# EAGLE board main (EAGLE 6.1)
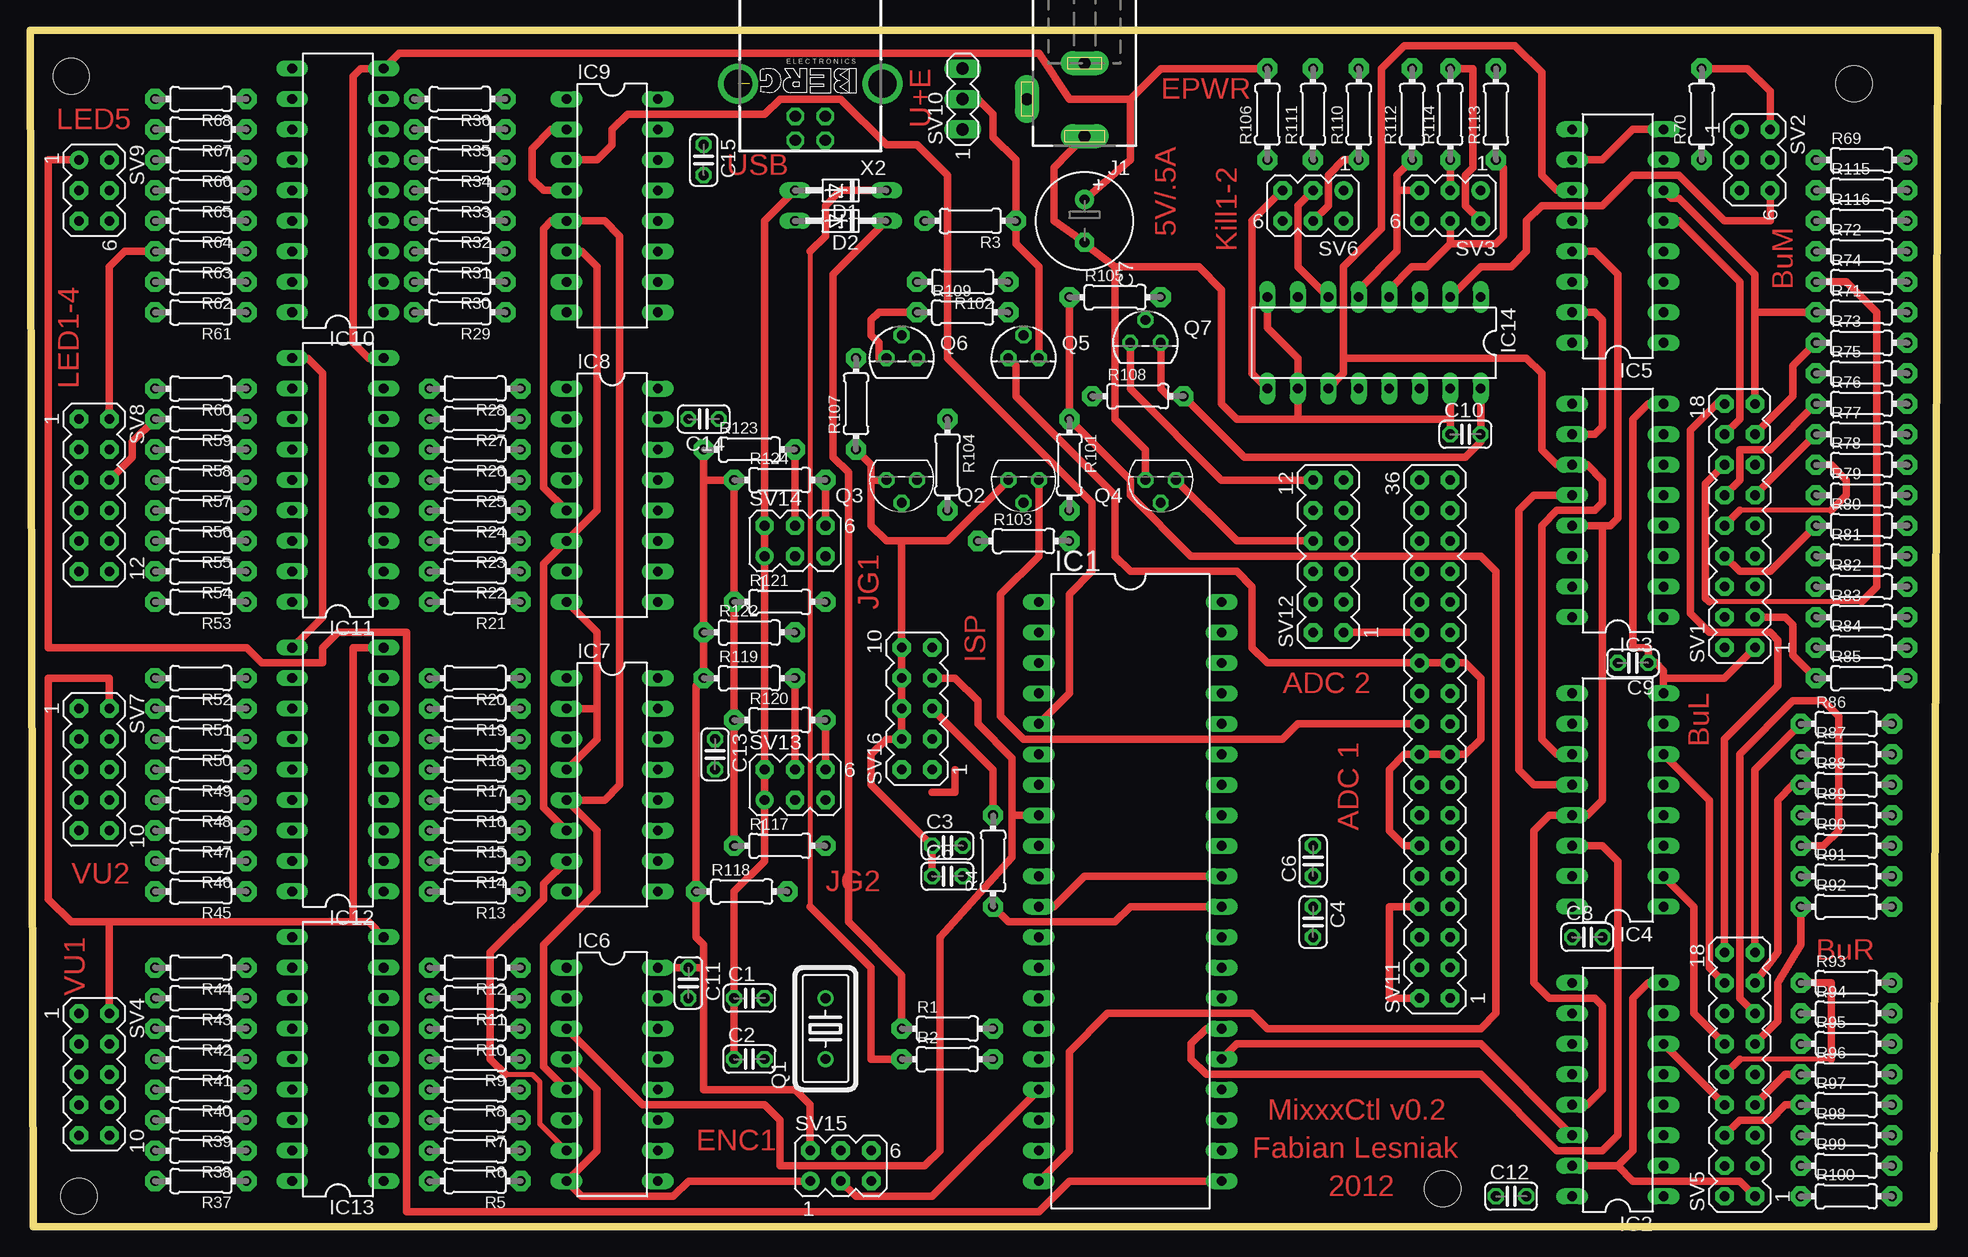
[diagram p1: board, top side]
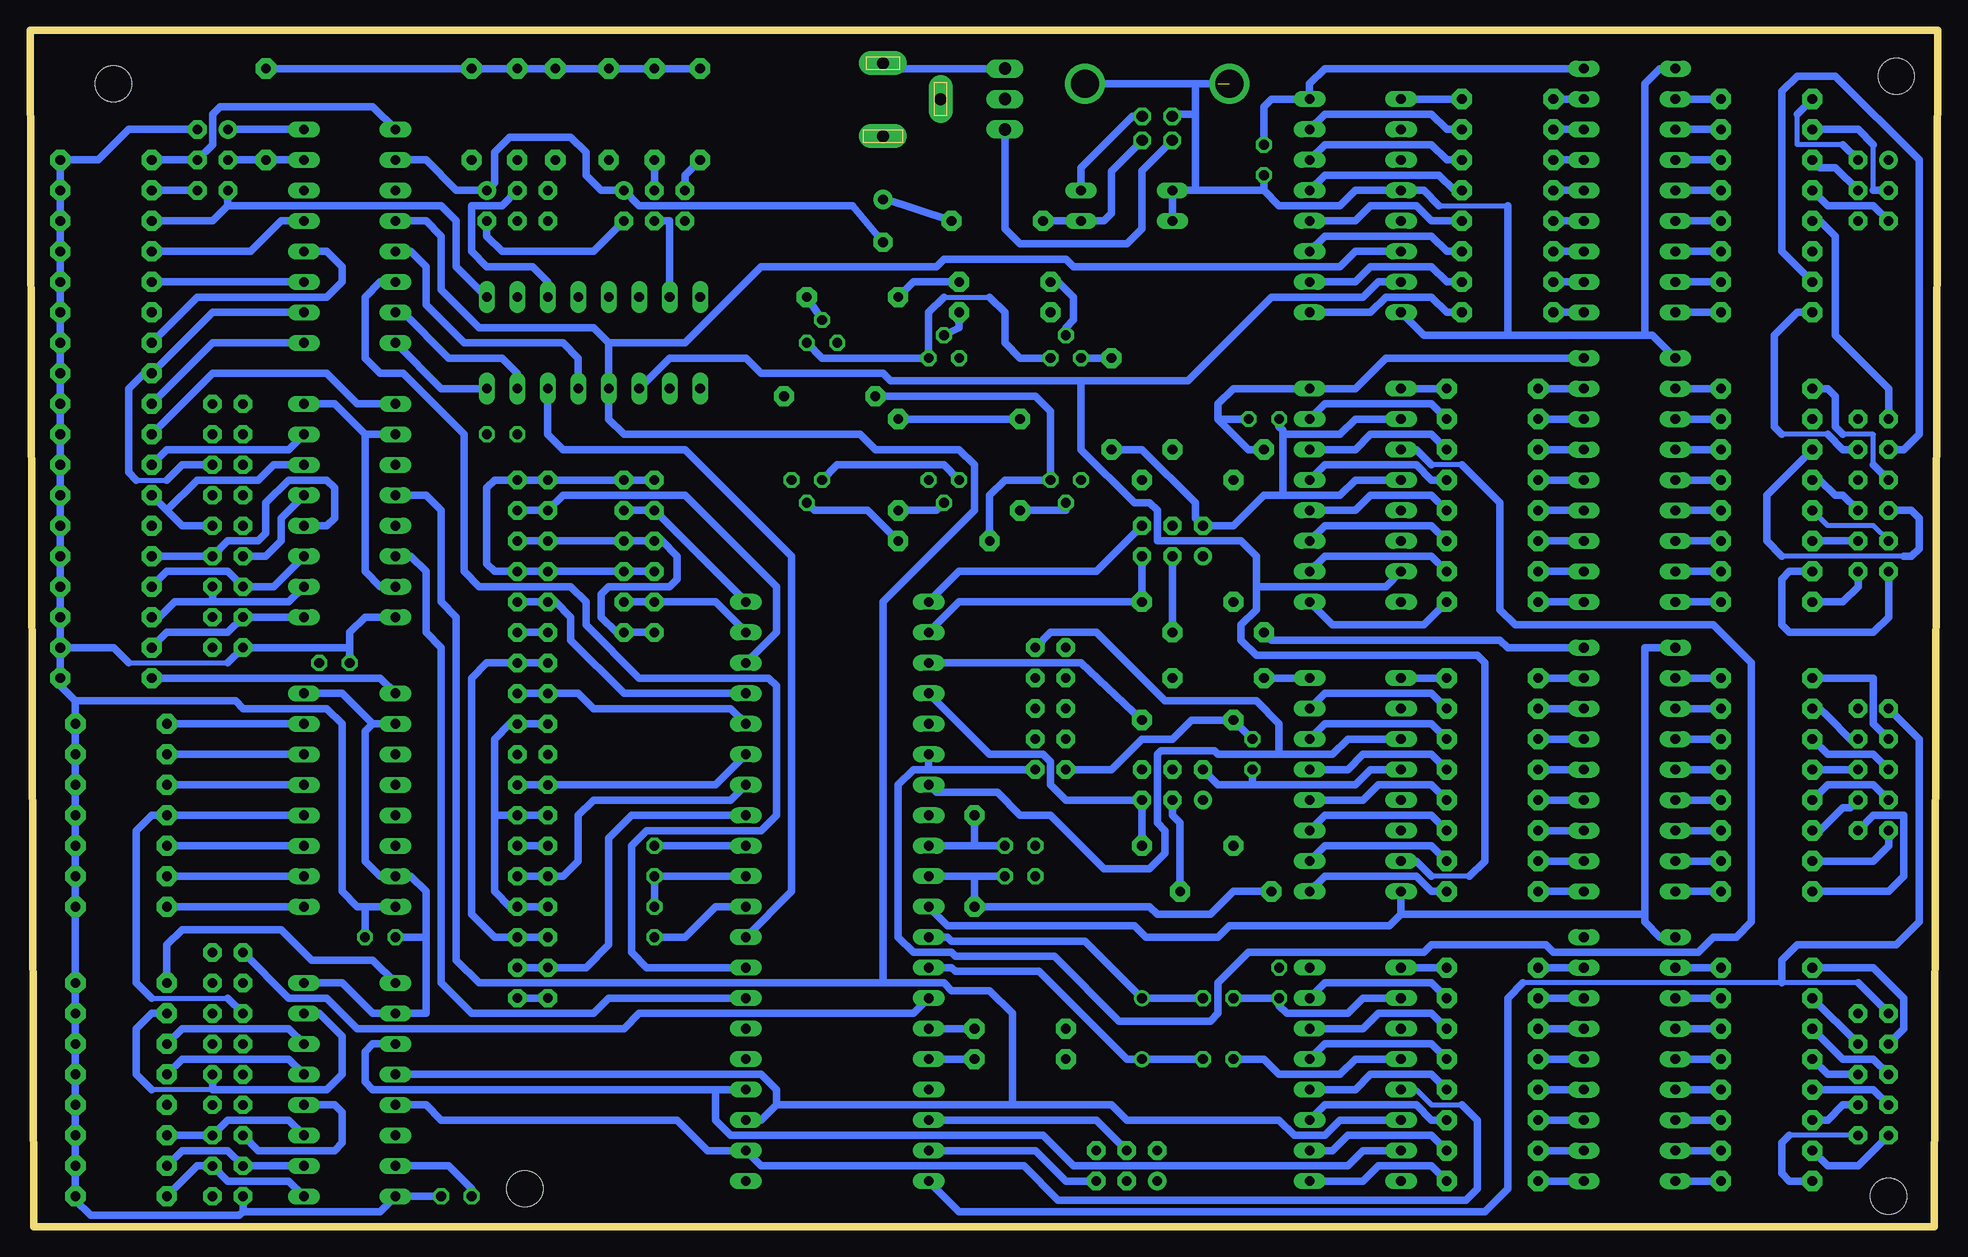
[diagram p2: board, bottom side, seen from below]

Size 159 x 99.73 mm. Coordinates in mm from the lower left corner, seen from the top.
Outline: 0.27,0 158.69,0 159,99.73 0,99.73 0.27,0
Copper layers (1*16): Top 0.035mm / dielectric 1.5mm / Bottom 0.035mm
Design rules "default": minimum track width 10mil, minimum drill 24mil, track to track 8mil, track to pad 8mil, pad to pad 8mil, via to via 8mil, smd to smd 8mil, copper to edge 40mil, drill to drill 8mil, minimum pad ring 10mil, minimum via ring 8mil, stop-mask expansion 4mil, vias tented up to drill 0mil, thermal gap 10mil
Net classes: 1 supply: width 0.015 mm
Holes 3 mm at 3.45,95.89 152.03,95.25 117.75,3.18 4.08,2.54

## Footprints (pad centres in the part's own frame; a part is rotated, then mirrored left to right if it is on the bottom)
C025-024X044 = drill 0.813 octagon: 1 -1.27,0; 2 1.27,0
E3,5-8 = drill 0.813 pad 1.6: + -1.778,0 | drill 0.813 pad 1.6 octagon: - 1.778,0
DO34Z7 = drill 0.813 long: A 3.81,0; C -3.81,0
DIL40 = drill 0.813 long: 1 -24.13,-7.62; 2 -21.59,-7.62; 3 -19.05,-7.62; 4 -16.51,-7.62; 5 -13.97,-7.62; 6 -11.43,-7.62; 7 -8.89,-7.62; 8 -6.35,-7.62; 9 -3.81,-7.62; 10 -1.27,-7.62; 11 1.27,-7.62; 12 3.81,-7.62; 13 6.35,-7.62; 14 8.89,-7.62; 15 11.43,-7.62; 16 13.97,-7.62; 17 16.51,-7.62; 18 19.05,-7.62; 19 21.59,-7.62; 20 24.13,-7.62; 21 24.13,7.62; 22 21.59,7.62; 23 19.05,7.62; 24 16.51,7.62; 25 13.97,7.62; 26 11.43,7.62; 27 8.89,7.62; 28 6.35,7.62; 29 3.81,7.62; 30 1.27,7.62; 31 -1.27,7.62; 32 -3.81,7.62; 33 -6.35,7.62; 34 -8.89,7.62; 35 -11.43,7.62; 36 -13.97,7.62; 37 -16.51,7.62; 38 -19.05,7.62; 39 -21.59,7.62; 40 -24.13,7.62
DIL16 = drill 0.813 long: 1 -8.89,-3.81; 2 -6.35,-3.81; 3 -3.81,-3.81; 4 -1.27,-3.81; 5 1.27,-3.81; 6 3.81,-3.81; 7 6.35,-3.81; 8 8.89,-3.81; 9 8.89,3.81; 10 6.35,3.81; 11 3.81,3.81; 12 1.27,3.81; 13 -1.27,3.81; 14 -3.81,3.81; 15 -6.35,3.81; 16 -8.89,3.81
DIL18 = drill 0.813 long: 1 -10.16,-3.81; 2 -7.62,-3.81; 3 -5.08,-3.81; 4 -2.54,-3.81; 5 0,-3.81; 6 2.54,-3.81; 7 5.08,-3.81; 8 7.62,-3.81; 9 10.16,-3.81; 10 10.16,3.81; 11 7.62,3.81; 12 5.08,3.81; 13 2.54,3.81; 14 0,3.81; 15 -2.54,3.81; 16 -5.08,3.81; 17 -7.62,3.81; 18 -10.16,3.81
DCJ0202 = drill 1 pad 2 long: 1 0,3.1; 2 4.8,0; 3 0,-3
HC18U-V = drill 0.813: 1 -2.54,0; 2 2.54,0
TO92 = drill 0.813 octagon: 1 1.27,0; 2 0,1.905; 3 -1.27,0
0204/7 = drill 0.813 pad 1.676 octagon: 1 -3.81,0; 2 3.81,0
MA09-2 = drill 0.8 pad 1.524 octagon: 1 -10.16,-1.27; 2 -10.16,1.27; 3 -7.62,-1.27; 4 -7.62,1.27; 5 -5.08,-1.27; 6 -5.08,1.27; 7 -2.54,-1.27; 8 -2.54,1.27; 9 0,-1.27; 10 0,1.27; 11 2.54,-1.27; 12 2.54,1.27; 13 5.08,-1.27; 14 5.08,1.27; 15 7.62,-1.27; 16 7.62,1.27; 17 10.16,-1.27; 18 10.16,1.27
MA03-2 = drill 0.8 pad 1.524: 1 -2.54,-1.27 | drill 0.8 pad 1.524 octagon: 2 -2.54,1.27; 3 0,-1.27; 4 0,1.27; 5 2.54,-1.27; 6 2.54,1.27
MA05-2 = drill 0.8 pad 1.524 octagon: 1 -5.08,-1.27; 2 -5.08,1.27; 3 -2.54,-1.27; 4 -2.54,1.27; 5 0,-1.27; 6 0,1.27; 7 2.54,-1.27; 8 2.54,1.27; 9 5.08,-1.27; 10 5.08,1.27
MA06-2 = drill 0.8 pad 1.524 octagon: 1 -6.35,-1.27; 2 -6.35,1.27; 3 -3.81,-1.27; 4 -3.81,1.27; 5 -1.27,-1.27; 6 -1.27,1.27; 7 1.27,-1.27; 8 1.27,1.27; 9 3.81,-1.27; 10 3.81,1.27; 11 6.35,-1.27; 12 6.35,1.27
MA03-1 = drill 1.016 long: 1 -2.54,0; 2 0,0; 3 2.54,0
MA18-2 = drill 0.8 pad 1.524 octagon: 1 -21.59,-1.27; 2 -21.59,1.27; 3 -19.05,-1.27; 4 -19.05,1.27; 5 -16.51,-1.27; 6 -16.51,1.27; 7 -13.97,-1.27; 8 -13.97,1.27; 9 -11.43,-1.27; 10 -11.43,1.27; 11 -8.89,-1.27; 12 -8.89,1.27; 13 -6.35,-1.27; 14 -6.35,1.27; 15 -3.81,-1.27; 16 -3.81,1.27; 17 -1.27,-1.27; 18 -1.27,1.27; 19 1.27,-1.27; 20 1.27,1.27; 21 3.81,-1.27; 22 3.81,1.27; 23 6.35,-1.27; 24 6.35,1.27; 25 8.89,-1.27; 26 8.89,1.27; 27 11.43,-1.27; 28 11.43,1.27; 29 13.97,-1.27; 30 13.97,1.27; 31 16.51,-1.27; 32 16.51,1.27; 33 19.05,-1.27; 34 19.05,1.27; 35 21.59,-1.27; 36 21.59,1.27
PN61729-S = drill 0.95 octagon: 1 1.25,4.71; 2 -1.25,4.71; 3 -1.25,2.71; 4 1.25,2.71 | drill 2.3 pad 2.9: S1 -6.02,0; S2 6.02,0

## Placement (x,y rotation side)
C1  22p  [C025-024X044]  59.96,19.05 0 top
C2  22p  [C025-024X044]  59.96,13.97 0 top
C3  47n  [C025-024X044]  76.47,31.75 0 top
C4  100n  [C025-024X044]  106.95,25.4 270 top
C5  100n  [C025-024X044]  76.47,29.21 0 top
C6  100n  [C025-024X044]  106.95,30.48 90 top
C7  100u  [E3,5-8]  87.9,83.82 270 top
C8  100n  [C025-024X044]  129.81,24.13 0 top
C9  100n  [C025-024X044]  133.62,46.99 180 top
C10  100n  [C025-024X044]  119.65,66.04 0 top
C11  100n  [C025-024X044]  54.88,20.32 270 top
C12  100n  [C025-024X044]  123.46,2.54 0 top
C13  100n  [C025-024X044]  57.1,39.37 270 top
C14  100n  [C025-024X044]  56.15,67.31 180 top
C15  100n  [C025-024X044]  56.15,88.9 270 top
D1  3,6  [DO34Z7]  67.58,86.36 180 top
D2  3,6  [DO34Z7]  67.58,83.82 180 top
IC1  ATMEGA644-20PU  [DIL40]  91.71,27.94 270 top
IC2  4512N  [DIL16]  132.35,11.43 90 top
IC3  4512N  [DIL16]  132.35,59.69 90 top
IC4  4512N  [DIL16]  132.35,35.56 90 top
IC5  4512N  [DIL16]  132.35,82.55 90 top
IC6  4099N  [DIL16]  48.53,12.7 270 top
IC7  4099N  [DIL16]  48.53,36.83 270 top
IC8  4099N  [DIL16]  48.53,60.96 270 top
IC9  4099N  [DIL16]  48.53,85.09 270 top
IC10  UDN2981A  [DIL18]  25.67,86.36 90 top
IC11  UDN2981A  [DIL18]  25.67,62.23 90 top
IC12  UDN2981A  [DIL18]  25.67,38.1 90 top
IC13  UDN2981A  [DIL18]  25.67,13.97 90 top
IC14  4512N  [DIL16]  112.03,73.66 180 top
J1  DCJ0202  [DCJ0202]  87.9,93.98 180 top
Q1  20MHz  [HC18U-V]  66.31,16.51 90 top
Q2  BC547B  [TO92]  82.82,62.23 180 top
Q3  BC547B  [TO92]  72.66,62.23 180 top
Q4  BC547B  [TO92]  94.25,62.23 180 top
Q5  BC557  [TO92]  82.82,72.39 0 top
Q6  BC557  [TO92]  72.66,72.39 0 top
Q7  BC557  [TO92]  92.98,73.66 0 top
R1  68  [0204/7]  76.47,16.51 0 top
R2  68  [0204/7]  76.47,13.97 0 top
R3  1k5  [0204/7]  78.38,83.82 180 top
R4  100k  [0204/7]  80.28,30.48 90 top
R5  100k  [0204/7]  37.1,3.81 180 top
R6  100k  [0204/7]  37.1,6.35 180 top
R7  100k  [0204/7]  37.1,8.89 180 top
R8  100k  [0204/7]  37.1,11.43 180 top
R9  100k  [0204/7]  37.1,13.97 180 top
R10  100k  [0204/7]  37.1,16.51 180 top
R11  100k  [0204/7]  37.1,19.05 180 top
R12  100k  [0204/7]  37.1,21.59 180 top
R13  100k  [0204/7]  37.1,27.94 180 top
R14  100k  [0204/7]  37.1,30.48 180 top
R15  100k  [0204/7]  37.1,33.02 180 top
R16  100k  [0204/7]  37.1,35.56 180 top
R17  100k  [0204/7]  37.1,38.1 180 top
R18  100k  [0204/7]  37.1,40.64 180 top
R19  100k  [0204/7]  37.1,43.18 180 top
R20  100k  [0204/7]  37.1,45.72 180 top
R21  100k  [0204/7]  37.1,52.07 180 top
R22  100k  [0204/7]  37.1,54.61 180 top
R23  100k  [0204/7]  37.1,57.15 180 top
R24  100k  [0204/7]  37.1,59.69 180 top
R25  100k  [0204/7]  37.1,62.23 180 top
R26  100k  [0204/7]  37.1,64.77 180 top
R27  100k  [0204/7]  37.1,67.31 180 top
R28  100k  [0204/7]  37.1,69.85 180 top
R29  100k  [0204/7]  35.83,76.2 180 top
R30  100k  [0204/7]  35.83,78.74 180 top
R31  100k  [0204/7]  35.83,81.28 180 top
R32  100k  [0204/7]  35.83,83.82 180 top
R33  100k  [0204/7]  35.83,86.36 180 top
R34  100k  [0204/7]  35.83,88.9 180 top
R35  100k  [0204/7]  35.83,91.44 180 top
R36  100k  [0204/7]  35.83,93.98 180 top
R37  100  [0204/7]  14.24,3.81 180 top
R38  100  [0204/7]  14.24,6.35 180 top
R39  100  [0204/7]  14.24,8.89 180 top
R40  100  [0204/7]  14.24,11.43 180 top
R41  100  [0204/7]  14.24,13.97 180 top
R42  100  [0204/7]  14.24,16.51 180 top
R43  100  [0204/7]  14.24,19.05 180 top
R44  100  [0204/7]  14.24,21.59 180 top
R45  100  [0204/7]  14.24,27.94 180 top
R46  100  [0204/7]  14.24,30.48 180 top
R47  100  [0204/7]  14.24,33.02 180 top
R48  100  [0204/7]  14.24,35.56 180 top
R49  100  [0204/7]  14.24,38.1 180 top
R50  100  [0204/7]  14.24,40.64 180 top
R51  100  [0204/7]  14.24,43.18 180 top
R52  100  [0204/7]  14.24,45.72 180 top
R53  100  [0204/7]  14.24,52.07 180 top
R54  100  [0204/7]  14.24,54.61 180 top
R55  100  [0204/7]  14.24,57.15 180 top
R56  100  [0204/7]  14.24,59.69 180 top
R57  100  [0204/7]  14.24,62.23 180 top
R58  100  [0204/7]  14.24,64.77 180 top
R59  100  [0204/7]  14.24,67.31 180 top
R60  100  [0204/7]  14.24,69.85 180 top
R61  100  [0204/7]  14.24,76.2 180 top
R62  100  [0204/7]  14.24,78.74 180 top
R63  100  [0204/7]  14.24,81.28 180 top
R64  100  [0204/7]  14.24,83.82 180 top
R65  100  [0204/7]  14.24,86.36 180 top
R66  100  [0204/7]  14.24,88.9 180 top
R67  100  [0204/7]  14.24,91.44 180 top
R68  100  [0204/7]  14.24,93.98 180 top
R69  100k  [0204/7]  152.67,88.9 0 top
R70  100k  [0204/7]  139.34,92.71 90 top
R71  100k  [0204/7]  152.67,76.2 0 top
R72  100k  [0204/7]  152.67,81.28 0 top
R73  100k  [0204/7]  152.67,73.66 0 top
R74  100k  [0204/7]  152.67,78.74 0 top
R75  100k  [0204/7]  152.67,71.12 0 top
R76  100k  [0204/7]  152.67,68.58 0 top
R77  100k  [0204/7]  152.67,66.04 0 top
R78  100k  [0204/7]  152.67,63.5 0 top
R79  100k  [0204/7]  152.67,60.96 0 top
R80  100k  [0204/7]  152.67,58.42 0 top
R81  100k  [0204/7]  152.67,55.88 0 top
R82  100k  [0204/7]  152.67,53.34 0 top
R83  100k  [0204/7]  152.67,50.8 0 top
R84  100k  [0204/7]  152.67,48.26 0 top
R85  100k  [0204/7]  152.67,45.72 0 top
R86  100k  [0204/7]  151.4,41.91 0 top
R87  100k  [0204/7]  151.4,39.37 0 top
R88  100k  [0204/7]  151.4,36.83 0 top
R89  100k  [0204/7]  151.4,34.29 0 top
R90  100k  [0204/7]  151.4,31.75 0 top
R91  100k  [0204/7]  151.4,29.21 0 top
R92  100k  [0204/7]  151.4,26.67 0 top
R93  100k  [0204/7]  151.4,20.32 0 top
R94  100k  [0204/7]  151.4,17.78 0 top
R95  100k  [0204/7]  151.4,15.24 0 top
R96  100k  [0204/7]  151.4,12.7 0 top
R97  100k  [0204/7]  151.4,10.16 0 top
R98  100k  [0204/7]  151.4,7.62 0 top
R99  100k  [0204/7]  151.4,5.08 0 top
R100  100k  [0204/7]  151.4,2.54 0 top
R101  100k  [0204/7]  86.63,63.5 270 top
R102  100k  [0204/7]  77.74,78.74 180 top
R103  100k  [0204/7]  82.82,57.15 0 top
R104  100k  [0204/7]  76.47,63.5 270 top
R105  100k  [0204/7]  90.44,77.47 0 top
R106  100k  [0204/7]  103.14,92.71 90 top
R107  100k  [0204/7]  68.85,68.58 90 top
R108  100k  [0204/7]  92.34,69.22 0 top
R109  100k  [0204/7]  77.74,76.2 0 top
R110  100k  [0204/7]  110.76,92.71 90 top
R111  100k  [0204/7]  106.95,92.71 90 top
R112  100k  [0204/7]  115.2,92.71 90 top
R113  100k  [0204/7]  122.19,92.71 90 top
R114  100k  [0204/7]  118.38,92.71 90 top
R115  100k  [0204/7]  152.67,86.36 0 top
R116  100k  [0204/7]  152.67,83.82 0 top
R117  100k  [0204/7]  62.5,31.75 0 top
R118  430  [0204/7]  59.33,27.94 0 top
R119  430  [0204/7]  59.96,45.72 0 top
R120  100k  [0204/7]  62.5,42.23 0 top
R121  100k  [0204/7]  62.5,52.07 0 top
R122  430  [0204/7]  59.96,49.53 0 top
R123  430  [0204/7]  59.96,64.77 0 top
R124  100k  [0204/7]  62.5,62.23 0 top
SV1  [MA09-2]  142.51,58.42 90 top
SV2  [MA03-2]  143.78,88.9 270 top
SV3  [MA03-2]  118.38,85.09 180 top
SV4  [MA05-2]  5.35,12.7 270 top
SV5  [MA09-2]  142.51,12.7 90 top
SV6  [MA03-2]  106.95,85.09 180 top
SV7  [MA05-2]  5.35,38.1 270 top
SV8  [MA06-2]  5.35,60.96 270 top
SV9  [MA03-2]  5.35,86.36 270 top
SV10  [MA03-1]  77.74,93.98 90 top
SV11  [MA18-2]  117.11,40.64 90 top
SV12  [MA06-2]  108.22,55.88 90 top
SV13  [MA03-2]  63.77,36.83 0 top
SV14  [MA03-2]  63.77,57.15 0 top
SV15  [MA03-2]  67.58,5.08 0 top
SV16  [MA05-2]  73.93,43.18 90 top
X2  PN61729-S  [PN61729-S]  65.04,95.25 180 top

## Tracks (layer width: path | path; a pad name or v marks a point on that pad's centre or on a via)
GND  (1 unrouted)
  Top 0.61: SV5.1 142.51,3.81 133.62,3.81 132.35,5.08 | IC2.15 132.35,5.08 | 132.35,5.08 133.62,6.35 133.62,19.05 134.89,20.32 IC2.8 | SV1.1 141.24,45.72 136.16,45.72 | IC5.10 131.08,88.9 133.62,91.44 IC5.8 | J1.1 85.36,88.27 85.36,83.82 C7.- 87.9,81.92 90.44,80.01 | 118.38,67.31 IC14.15 | 105.68,67.31 118.38,67.31 | IC3.10 130.44,66.04 131.08,66.67 131.08,75.56 130.44,76.2 IC5.15 | 136.16,45.72 136.16,46.35 135.53,46.99 C9.1 134.89,48.26 133.62,48.26 133.62,67.31 134.89,68.58 IC3.8 | IC1.11 85.36,26.67 87.9,29.21 IC1.31 | C5.1 C3.1 70.12,36.83 70.12,39.37 71.39,40.64 SV16.4 SV16.6 SV16.8 SV16.10 72.66,57.15 | R107.1 70.12,63.5 70.12,62.23 | 72.66,57.15 76.47,57.15 Q2.1 | 70.12,62.23 Q3.1 | 72.66,57.15 71.39,57.15 70.12,58.42 70.12,62.23 | IC6.4 47.26,11.43 47.26,6.35 IC6.8 45.99,2.54 53.61,2.54 54.88,3.81 SV15.1 | IC9.4 42.81,86.36 41.86,87.31 41.86,89.85 43.45,91.44 IC9.2 | C2.1 C1.1 58.69,27.94 61.23,30.48 SV13.1 SV13.2 SV14.1 SV14.2 61.23,83.82 D1.A | IC7.4 47.26,40.64 47.26,43.18 | IC7.2 47.26,43.18 | IC8.8 47.26,49.53 47.26,43.18 | IC12.10 24.4,50.8 24.4,71.12 23.13,72.39 IC11.10 | 105.68,67.31 IC14.10 105.68,72.39 103.14,74.93 IC14.8 | 105.68,67.31 100.6,67.31 99.33,68.58 99.33,78.11 97.42,80.01 90.44,80.01 | 90.44,80.01 90.44,67.31 92.98,64.77 Q4.1 | 136.16,45.72 IC4.8 | 118.38,67.31 C10.1
  Bottom 0.406: 41.55,85.09 35.83,85.09
  Bottom 0.61: 126,24.13 126,17.78 IC2.10 130.44,17.78 132.99,20.32 IC2.8 | 126,24.13 126,27.94 127.27,29.21 IC4.15 129.81,29.21 131.08,30.48 131.08,41.27 130.44,41.91 | 130.44,41.91 IC4.10 | 130.44,41.91 132.99,44.45 IC4.8 | IC5.10 126,88.9 123.46,86.36 SV3.1 120.28,87 120.28,89.54 119.02,90.81 113.94,90.81 112.67,89.54 112.67,87.63 111.39,86.36 SV6.1 108.22,85.09 90.44,85.09 C7.- | IC3.15 129.81,53.34 131.08,54.61 131.08,66.04 | 131.08,66.04 133.62,68.58 IC3.8 | IC3.10 131.08,66.04 | IC5.15 127.91,76.2 124.09,72.39 119.65,72.39 118.38,71.12 IC14.15 | C4.1 C6.1 IC1.31 | IC13.10 23.13,24.13 24.4,25.4 24.4,26.04 | 24.4,26.04 24.4,48.26 IC12.10 | 24.4,26.04 44.72,26.04 | IC1.11 82.5,25.08 66.94,25.08 65.99,24.13 59.96,24.13 59.01,25.08 45.67,25.08 44.72,26.04 | IC7.8 44.72,26.04 | IC11.10 23.77,74.3 24.4,74.3 | 24.4,74.3 24.4,95.25 23.13,96.52 IC10.10 | IC9.8 42.81,74.3 35.83,74.3 | 24.4,74.3 35.83,74.3 | Q4.1 91.71,63.5 82.82,63.5 Q2.1 | 61.87,86.36 56.15,86.36 | IC6.2 47.9,19.05 49.16,17.78 54.24,17.78 54.88,18.41 C11.2 C1.1 | IC8.4 48.53,62.23 49.8,60.96 54.56,60.96 | 54.56,60.96 56.15,60.96 58.69,58.42 SV14.2 61.87,59.05 61.87,60.32 66.31,64.77 R107.1 | IC8.2 48.53,67.31 49.8,66.04 54.56,66.04 | 54.56,60.96 54.56,66.04 | IC7.4 47.26,38.1 48.53,36.83 57.1,36.83 | SV13.2 59.96,36.83 57.1,36.83 | 57.1,36.83 C13.2 | IC6.4 48.53,13.97 49.8,12.7 54.88,12.7 56.15,13.97 C2.1 | 35.83,85.09 35.83,74.3 | 41.55,85.09 42.81,86.36 IC9.4 48.53,86.36 49.8,85.09 54.88,85.09 56.15,86.36 | IC2.15 124.09,5.08 122.19,3.18 C12.1 | C8.1 126,24.13 | C15.2 56.15,86.36 | 54.56,66.04 54.56,66.36 54.88,66.67 C14.2 | IC5.8 SV2.1
  Bottom 0.61: 61.87,95.25 X2.S1 | X2.4 63.96,92.71 61.87,92.71 | 61.87,92.71 61.87,86.36 | 61.87,86.36 D1.A D2.A | 59.96,95.25 61.87,95.25 | 61.87,95.25 61.87,92.71
N$1
  Top 0.61: SV1.3 146.32,50.8 146.96,50.16 146.96,47.62 R85.1
  Bottom 0.61: IC4.9 129.81,45.72 R85.1
N$2
  Bottom 0.61: C2.2 Q1.1 67.58,13.97 74.88,21.27 81.87,21.27 82.19,21.59 IC1.13
N$3
  Bottom 0.61: C1.2 Q1.2 71.07,23.81 82.19,23.81 82.5,24.13 IC1.12
N$4
  Top 0.61: SV1.18 140.6,68.58 138.38,66.36 138.38,51.12 139.97,49.53 145.05,49.53 145.69,48.89 145.69,45.08 141.24,40.64 SV5.18
  Bottom 0.61: IC1.14 85.36,17.78 108.22,17.78 109.49,16.51 131.72,16.51 134.25,19.05 137.43,19.05 SV5.18
N$5
  Top 0.406: 65.04,81.28 65.04,26.67
  Top 0.61: D1.C 67.58,86.36 66.31,85.09 66.31,82.55 65.04,81.28 | 65.04,26.67 70.12,21.59 70.12,13.97 R2.1
  Bottom 0.61: D1.C 71.39,88.27 67.11,92.54 X2.3
N$6
  Top 0.61: D2.C 66.94,79.38 66.94,64.14 68.22,62.87 68.22,25.4 72.66,20.96 R1.1
  Bottom 0.61: X2.2 68.85,87.98 68.85,84.45 69.48,83.82 D2.C R3.2
N$7
  Bottom 0.61: IC1.16 R2.2
N$8
  Bottom 0.61: IC1.15 R1.2
N$9
  Top 0.61: SV16.5 80.28,38.1 R4.2
  Bottom 0.61: 80.28,31.75 C3.2 | 80.28,31.75 IC1.9 | R4.2 80.28,31.75
N$10
  Bottom 0.61: R13.1 42.18,27.94 43.45,29.21 51.07,29.21 IC7.9
N$11
  Bottom 0.61: R15.1 42.18,34.29 51.07,34.29 IC7.11
N$12
  Bottom 0.61: C6.2 IC1.32
N$13
  Bottom 0.61: R17.1 42.18,39.37 47.9,39.37 49.16,38.1 IC7.13
N$14
  Bottom 0.61: R19.1 42.18,44.45 51.07,44.45 IC7.15
N$15
  Bottom 0.406: 39.64,63.5 42.18,63.5
  Bottom 0.61: 84.09,38.1 IC1.6 | SV16.1 84.09,38.1 | IC8.3 43.45,64.77 42.18,63.5 | 39.64,63.5 36.47,60.32 36.47,51.43 35.2,50.16 18.68,50.16 15.51,46.99 15.51,25.4 16.78,24.13 18.68,24.13 19.95,22.86 32.02,22.86 32.66,23.5 42.18,23.5 42.81,22.86 57.42,22.86 59.96,20.32 59.96,17.78 60.59,17.14 68.22,17.14 73.61,22.54 81.87,22.54 82.19,22.86 85.36,22.86 86.63,24.13 86.63,36.83 85.36,38.1 84.09,38.1
N$16
  Top 0.61: IC1.5 86.63,44.45 86.63,52.7 88.53,54.61 88.53,60.32 76.47,72.39 76.47,87.63 73.93,90.17 71.39,90.17 67.58,93.98 62.5,93.98 61.23,92.71 49.8,92.71 48.53,91.44 48.53,90.17 47.26,88.9 46.62,88.9 IC9.3
N$17
  Top 0.61: IC7.6 42.81,34.92 42.81,55.24 IC8.6 47.26,59.69 47.26,80.01 45.99,81.28 IC9.6 | IC4.12 125.36,36.83 124.09,38.1 124.09,59.69 125.36,60.96 IC3.12
  Bottom 0.61: 110.76,73.66 IC14.12 110.76,67.31 109.49,66.04 89.81,66.04 88.53,64.77 81.55,64.77 80.28,63.5 80.28,59.69 87.9,52.07 87.9,20.32 | 110.76,73.66 112.03,74.93 121.56,74.93 124.73,78.11 124.73,82.55 126,83.82 IC5.12 | IC9.6 48.53,81.28 49.8,80.01 72.03,80.01 72.66,80.65 82.82,80.65 83.45,80.01 98.06,80.01 104.41,73.66 110.76,73.66 | IC6.6 49.8,8.89 51.07,7.62 53.61,7.62 54.88,8.89 67.58,8.89 68.85,10.16 77.11,10.16 | 96.79,10.16 77.11,10.16 | IC1.23 98.06,8.89 96.79,10.16 | IC3.12 126,60.96 124.73,59.69 124.73,52.07 123.46,50.8 123.46,22.23 121.56,20.32 87.9,20.32 | 87.9,20.32 82.82,20.32 82.19,19.68 79.01,19.68 77.11,17.78 77.11,10.16 | IC2.12 98.06,12.7 96.79,11.43 96.79,10.16
N$18
  Top 0.61: 131.08,58.42 131.08,35.56 129.81,34.29 IC4.13 126.64,34.29 125.36,33.02 125.36,20.32 126.64,19.05 130.44,19.05 131.08,18.41 131.08,11.43 129.81,10.16 IC2.13 | 131.08,58.42 131.72,58.42 132.35,59.05 132.35,79.38 130.44,81.28 IC5.13 | 131.08,58.42 IC3.13 | IC8.5 42.81,61.59 42.81,83.19 43.45,83.82 IC9.5 47.9,83.82 49.16,82.55 49.16,36.83 47.9,35.56 IC7.5 47.26,33.02 47.26,27.94 42.81,23.5 42.81,13.34 IC6.5
  Bottom 0.406: 39.64,10.16 42.18,10.16 43.45,11.43 IC6.5
  Bottom 0.61: IC14.13 113.3,72.39 114.57,73.66 122.83,73.66 126,76.84 126,80.01 127.27,81.28 IC5.13 | IC2.13 126,10.16 124.73,8.89 105.05,8.89 102.5,6.35 IC1.22 98.06,5.08 76.15,5.08 73.3,2.22 39.32,2.22 38.37,3.18 38.37,8.89 39.64,10.16
N$19
  Top 0.406: IC6.7 42.5,8.57 42.5,12.07 41.86,12.7 39.64,12.7
  Top 0.61: IC5.11 127.27,86.36 126,87.63 126,96.2 123.78,98.42 114.57,98.42 112.67,96.52 112.67,83.19 109.49,80.01 109.49,72.39 | IC14.11 109.49,71.12 109.49,72.39 | 39.64,12.7 38.37,13.97 38.37,22.86 42.81,27.3 42.81,28.57 IC7.7 | 109.49,72.39 124.73,72.39 126,71.12 126,64.77 127.27,63.5 IC3.11 129.81,63.5 131.08,62.23 131.08,60.32 130.44,59.69 127.27,59.69 126,58.42 126,40.64 127.27,39.37 IC4.11
  Bottom 0.406: 39.01,29.21 42.18,29.21
  Bottom 0.61: IC6.7 47.9,6.35 49.16,5.08 72.03,5.08 74.56,7.62 100.6,7.62 101.87,8.89 101.87,11.43 | IC1.24 101.87,11.43 | IC2.11 130.44,15.24 131.08,14.61 131.08,12.07 130.44,11.43 101.87,11.43 | IC7.7 43.45,30.48 42.18,29.21 | 39.01,29.21 37.73,30.48 37.73,46.99 38.37,47.62 56.78,47.62 58.05,48.89 58.05,50.16 56.78,51.43 56.78,53.34 | 56.78,53.34 45.99,53.34 IC8.7 | IC14.11 105.68,72.39 99.33,72.39 98.06,71.12 87.9,71.12 87.27,70.48 71.39,70.48 | 71.39,70.48 62.5,70.48 55.52,77.47 47.9,77.47 46.62,78.74 IC9.7 | 56.78,53.34 56.78,55.88 58.05,57.15 65.04,57.15 65.04,59.69 65.67,60.32 66.94,60.32 71.39,64.77 71.39,70.48
N$20
  Bottom 0.61: R21.1 42.81,50.16 50.44,50.16 IC8.9
N$21
  Bottom 0.61: R22.1 42.18,55.88 51.07,55.88 IC8.10
N$22
  Bottom 0.61: R23.1 42.18,58.42 51.07,58.42 IC8.11
N$23
  Bottom 0.61: R24.1 42.18,60.96 47.26,60.96 48.53,59.69 IC8.12
N$24
  Bottom 0.61: IC1.27 110.76,19.05 112.03,17.78 122.19,17.78 124.73,20.32 124.73,48.26 126,49.53 126,54.61 127.27,55.88 IC3.14
N$25
  Top 0.61: IC1.25 100.6,15.24 120.92,15.24 IC2.14
N$26
  Bottom 0.61: 147.59,59.69 146.32,58.42 SV1.9 | 147.59,59.69 R79.1 | IC3.6 138.7,63.5 139.97,62.23 145.05,62.23 147.59,59.69
N$27
  Top 0.61: R77.1 SV1.11
  Bottom 0.61: R77.1 143.78,71.12 134.25,71.12 131.72,68.58 IC3.9
N$28
  Bottom 0.61: IC12.12 R51.1
N$29
  Bottom 0.61: R25.1 42.18,62.23 43.45,63.5 51.07,63.5 IC8.13
N$30
  Bottom 0.61: R26.1 42.18,66.04 47.26,66.04 48.53,64.77 IC8.14
N$31
  Bottom 0.61: R27.1 42.18,68.58 51.07,68.58 IC8.15
N$32
  Bottom 0.61: IC8.1 R28.1
N$33
  Bottom 0.61: R12.2 IC13.8
N$34
  Bottom 0.61: R11.2 IC13.7
N$35
  Bottom 0.61: R10.2 IC13.6
N$36
  Bottom 0.61: R9.2 IC13.5
N$37
  Bottom 0.61: R8.2 IC13.4
N$38
  Bottom 0.61: R7.2 IC13.3
N$39
  Bottom 0.61: R6.2 IC13.2
N$40
  Bottom 0.61: R5.2 IC13.1
N$41
  Bottom 0.61: R29.2 IC10.1
N$42
  Bottom 0.61: R30.2 IC10.2
N$43
  Bottom 0.61: R31.2 IC10.3
N$44
  Bottom 0.61: R32.2 IC10.4
N$45
  Bottom 0.61: R33.2 IC10.5
N$46
  Bottom 0.61: R34.2 IC10.6
N$47
  Bottom 0.61: R35.2 IC10.7
N$48
  Bottom 0.61: R36.2 IC10.8
N$49
  Bottom 0.61: R30.1 40.91,78.74 42.18,80.01 47.26,80.01 48.53,78.74 IC9.10
N$50
  Bottom 0.61: R32.1 42.18,83.82 43.45,85.09 47.26,85.09 48.53,83.82 IC9.12
N$51
  Bottom 0.61: R34.1 40.91,88.9 42.18,90.17 51.07,90.17 IC9.14
N$52
  Bottom 0.61: IC9.1 R36.1
N$53
  Bottom 0.61: R21.2 IC11.1
N$54
  Bottom 0.61: R29.1 40.91,76.2 42.18,77.47 45.99,77.47 47.26,76.2 IC9.9
N$55
  Bottom 0.61: R31.1 40.91,81.28 42.18,82.55 51.07,82.55 IC9.11
N$56
  Bottom 0.61: IC1.28 107.58,21.59 108.86,22.86 108.86,31.75 107.58,33.02 98.06,33.02 96.79,34.29 96.79,45.08 97.42,45.72 108.22,45.72 112.67,50.16 112.67,52.07 113.94,53.34 121.56,53.34 122.83,54.61 122.83,66.04 127.91,71.12 129.81,71.12 131.08,72.39 131.08,77.47 129.81,78.74 IC5.14
N$57
  Top 0.61: IC1.26 98.06,16.51 96.79,15.24 96.79,13.97 98.06,12.7 120.92,12.7 127.27,6.35 131.08,6.35 132.35,7.62 132.35,30.48 131.08,31.75 IC4.14
N$58
  Bottom 0.61: R33.1 40.27,86.36 41.55,87.63 51.07,87.63 IC9.13
N$59
  Bottom 0.61: R22.2 IC11.2
N$60
  Bottom 0.61: R35.1 40.91,91.44 42.18,92.71 51.07,92.71 IC9.15
N$61
  Bottom 0.61: R23.2 IC11.3
N$62
  Bottom 0.61: R24.2 IC11.4
N$63
  Top 0.61: IC6.3 51.07,10.16 61.23,10.16 62.5,8.89 62.5,5.08 74.56,5.08 75.83,6.35 75.83,24.13 81.87,30.8 81.87,34.29 | IC1.8 81.87,34.29 | SV16.7 77.11,45.72 79.01,43.81 79.01,41.91 81.87,39.05 81.87,34.29
N$64
  Bottom 0.61: IC1.7 83.45,36.2 78.38,36.2 76.47,34.29 73.93,34.29 69.48,29.84 65.67,29.84 64.41,31.11 64.41,33.02 65.04,33.65 65.04,39.37 64.72,39.69 60.28,39.69 59.96,39.37 54.88,39.37 | 54.88,39.37 50.44,39.37 49.16,40.64 IC7.3 | SV16.9 73.93,49.53 70.12,49.53 64.41,43.81 56.78,43.81 54.88,41.91 54.88,39.37
N$65
  Bottom 0.61: R25.2 IC11.5
N$66
  Bottom 0.61: R26.2 IC11.6
N$67
  Bottom 0.61: R27.2 IC11.7
N$68
  Bottom 0.61: R5.1 42.18,5.08 46.62,5.08 47.9,3.81 IC6.9
N$69
  Bottom 0.61: R6.1 42.18,7.62 49.16,7.62 50.44,6.35 IC6.10
N$70
  Bottom 0.61: R7.1 42.18,8.89 43.45,10.16 51.07,10.16 IC6.11
N$71
  Bottom 0.61: R8.1 42.18,12.7 47.26,12.7 48.53,11.43 IC6.12
N$72
  Bottom 0.61: R9.1 42.18,15.24 51.07,15.24 IC6.13
N$73
  Bottom 0.61: R10.1 42.18,17.78 46.62,17.78 47.9,16.51 IC6.14
N$74
  Bottom 0.61: R11.1 42.18,20.32 51.07,20.32 IC6.15
N$75
  Bottom 0.61: IC6.1 R12.1
N$76
  Bottom 0.61: R28.2 IC11.8
N$77
  Bottom 0.61: IC13.18 R37.1
N$78
  Bottom 0.61: IC13.17 R38.1
N$79
  Bottom 0.406: SV4.10 12.34,7.62
  Bottom 0.61: R37.2 12.34,3.81 12.97,4.45 12.97,6.99 12.34,7.62
N$80
  Bottom 0.61: R38.2 9.16,5.08 6.62,5.08 SV4.9
N$81
  Bottom 0.61: R69.1 SV2.4 143.78,90.17 143.78,92.71 143.15,93.34 130.44,93.34 IC5.9
N$82
  Bottom 0.61: SV8.12 6.62,53.34 7.89,52.07 8.53,52.07 R53.2
N$83
  Bottom 0.61: SV4.8 7.89,10.16 9.16,8.89 R39.2
N$84
  Bottom 0.61: R13.2 IC12.1
N$85
  Bottom 0.61: R14.2 IC12.2
N$86
  Bottom 0.61: R15.2 IC12.3
N$87
  Bottom 0.61: R16.2 IC12.4
N$88
  Bottom 0.61: R17.2 IC12.5
N$89
  Bottom 0.61: R18.2 IC12.6
N$90
  Bottom 0.61: R19.2 IC12.7
N$91
  Bottom 0.61: R20.2 IC12.8
N$92
  Bottom 0.61: R14.1 42.18,31.75 51.07,31.75 IC7.10
N$93
  Bottom 0.61: R16.1 42.18,36.83 46.62,36.83 47.9,35.56 IC7.12
N$94
  Bottom 0.61: IC13.16 R39.1
N$95
  Bottom 0.61: IC13.15 R40.1
N$96
  Bottom 0.61: R40.2 5.35,11.43 SV4.7
N$97
  Bottom 0.61: R41.2 9.16,12.7 SV4.6
N$98
  Top 0.61: IC5.6 136.79,85.73 137.43,85.73 142.51,80.65 143.78,79.38 143.78,76.2 | SV1.17 143.78,76.2 | 143.78,76.2 R71.1
N$99
  Bottom 0.61: R18.1 42.18,41.91 51.07,41.91 IC7.14
N$100
  Bottom 0.61: IC7.1 R20.1
N$101
  Bottom 0.61: R81.1 SV1.7 142.51,57.15 139.97,57.15 139.34,57.78 139.34,60.32 137.43,62.23 134.25,62.23 133.62,61.59 133.62,59.05 134.25,58.42 IC3.4
N$102
  Bottom 0.61: IC13.14 R41.1
N$103
  Bottom 0.61: IC13.13 R42.1
N$104
  Bottom 0.61: R42.2 7.89,13.97 5.35,13.97 SV4.5
N$105
  Bottom 0.61: SV4.4 R43.2
N$106
  Top 0.61: SV1.15 146.96,69.22 146.96,71.76 R73.1
  Bottom 0.61: IC5.4 134.25,81.28 132.99,80.01 132.99,78.74 134.25,77.47 145.05,77.47 R73.1
N$107
  Bottom 0.61: SV1.5 143.78,52.07 | 143.78,52.07 146.96,52.07 148.22,50.8 R83.1 | IC3.2 137.43,52.07 143.78,52.07
N$108
  Bottom 0.61: IC13.12 R43.1
N$109
  Bottom 0.61: IC13.11 R44.1
N$110
  Bottom 0.61: IC12.13 R50.1
N$111
  Bottom 0.406: 150.13,62.23 147.59,62.23
  Bottom 0.61: IC5.2 143.78,76.2 R75.1 149.5,71.12 150.76,69.85 150.76,62.87 150.13,62.23 | SV1.13 146.32,63.5 147.59,62.23
N$112
  Bottom 0.61: R54.2 12.34,54.61 12.97,53.97 12.97,50.16 12.34,49.53 5.35,49.53 4.08,50.8 SV8.11
N$113
  Bottom 0.61: R82.1 147.59,54.61 142.51,54.61 SV1.6 138.7,53.34 IC3.3
N$114
  Bottom 0.61: IC12.18 R45.1
N$115
  Bottom 0.61: IC12.17 R46.1
N$116
  Bottom 0.61: R44.2 5.35,21.59 2.81,19.05 2.81,16.51 SV4.3
N$117
  Bottom 0.61: SV10.3 87.9,96.52 J1.3
N$118
  Bottom 0.61: IC12.16 R47.1
N$119
  Bottom 0.61: IC12.15 R48.1
N$120
  Bottom 0.61: R45.2 4.08,27.94 2.81,29.21 2.81,34.29 5.35,34.29 SV7.10
N$121
  Bottom 0.61: R46.2 5.35,30.48 4.08,31.75 SV7.9
N$122
  Bottom 0.61: IC12.14 R49.1
N$123
  Bottom 0.61: IC11.12 R59.1
N$124
  Bottom 0.61: SV7.8 7.26,34.92 7.89,34.92 9.79,33.02 R47.2
N$125
  Bottom 0.61: R48.2 9.16,36.83 5.35,36.83 SV7.7
N$126
  Bottom 0.61: SV8.10 R55.2
N$127
  Bottom 0.61: SV7.6 R49.2
N$128
  Bottom 0.61: R50.2 9.16,39.37 5.35,39.37 SV7.5
N$129
  Bottom 0.61: IC12.11 R52.1
N$130
  Bottom 0.61: SV7.4 7.26,40.64 9.16,42.54 9.79,43.18 R51.2
N$131
  Bottom 0.61: IC11.18 R53.1
N$132
  Bottom 0.61: IC11.17 R54.1
N$133
  Bottom 0.61: R52.2 5.35,45.72 5.35,41.91 SV7.3
N$134
  Bottom 0.61: IC5.7 R70.1 SV2.3
N$135
  Bottom 0.61: IC11.16 R55.1
N$136
  Bottom 0.61: IC11.15 R56.1
N$137
  Bottom 0.61: IC1.33 108.86,34.29 110.76,32.38 110.76,23.5 112.67,21.59 SV11.4 SV11.3
N$138
  Bottom 0.61: IC3.1 SV1.4 142.51,49.53 147.59,49.53 R84.1
N$139
  Bottom 0.61: IC11.14 R57.1
N$140
  Bottom 0.61: IC11.13 R58.1
N$141
  Bottom 0.406: R56.2 9.16,58.42 5.35,58.42 SV8.9
N$142
  Bottom 0.61: SV8.8 7.89,60.96 8.53,60.96 9.79,62.23 R57.2
N$143
  Bottom 0.406: 2.81,55.88 12.97,55.88
  Bottom 0.61: R58.2 14.24,60.96 14.24,57.15 12.97,55.88 | 2.81,55.88 2.17,55.88 1.54,56.51 1.54,59.05 2.17,59.69 SV8.7
N$144
  Top 0.61: R59.2 8.53,65.41 8.53,64.14 SV8.6
N$145
  Bottom 0.406: 5.35,63.5 5.35,66.04 7.89,66.04
  Bottom 0.61: R60.2 9.16,69.85 8.53,69.22 8.53,66.67 7.89,66.04 | SV8.5 5.35,63.5
N$146
  Bottom 0.61: IC11.11 R60.1
N$147
  Bottom 0.406: 9.16,66.04 12.97,66.04
  Bottom 0.61: R61.2 11.7,76.2 13.61,74.3 13.61,66.67 12.97,66.04 | 9.16,66.04 7.89,64.77 SV8.4
N$148
  Bottom 0.61: IC10.18 R61.1
N$149
  Bottom 0.61: IC10.17 R62.1
N$150
  Bottom 0.61: R62.2 12.97,81.28 12.97,94.62 11.7,95.89 8.53,95.89 1.54,88.9 1.54,66.04 2.81,64.77 SV8.3
N$151
  Bottom 0.61: IC1.34 100.6,35.56 112.03,35.56 113.3,34.29 113.3,30.48 114.57,29.21 SV11.10 SV11.9
N$152
  Bottom 0.61: IC10.16 R63.1
N$153
  Bottom 0.61: IC10.15 R64.1
N$154
  Top 0.61: SV5.17 143.78,38.1 R86.1
  Bottom 0.61: R86.1 IC4.7
N$155
  Top 0.61: SV5.16 139.97,21.59 139.97,35.56 IC4.6
  Bottom 0.61: R87.1 IC4.6
N$156
  Bottom 0.61: IC10.14 R65.1
N$157
  Bottom 0.61: IC10.13 R66.1
N$158
  Top 0.61: SV5.15 145.69,22.86 145.69,35.56 146.96,36.83 R88.1
  Bottom 0.61: R88.1 IC4.5
N$159
  Bottom 0.406: 148.86,19.05 142.51,19.05
  Bottom 0.61: IC4.4 R89.1 148.86,34.29 150.13,33.02 150.13,20.32 148.86,19.05 | 142.51,19.05 SV5.14
N$160
  Bottom 0.61: IC10.12 R67.1
N$161
  Top 0.61: SV5.13 142.51,19.05 142.51,39.37 146.96,43.81 149.5,43.81 150.76,42.54 150.76,33.02 149.5,31.75 R90.1
  Bottom 0.61: R90.1 IC4.3
N$162
  Bottom 0.61: IC1.29 95.52,27.94 95.52,55.88 104.41,64.77 114.57,64.77 115.84,66.04 IC14.14
N$163
  Bottom 0.61: IC10.11 R68.1
N$164
  Top 0.61: SV1.16 142.51,67.31 142.51,78.74 137.43,83.82 IC5.5
  Bottom 0.61: R72.1 140.6,81.28 138.06,83.82 IC5.5
N$165
  Top 0.61: SV5.12 138.7,17.78 138.7,26.67 IC4.2
  Bottom 0.61: R91.1 IC4.2
N$166
  Top 0.61: R63.2 7.89,81.28 6.62,80.01 SV8.2
N$167
  Top 0.61: SV5.11 145.69,17.14 145.69,20.32 147.59,23.5 R92.1
  Bottom 0.61: R92.1 IC4.1
N$168
  Top 0.406: 150.13,13.97 142.51,13.97
  Top 0.61: 142.51,13.97 SV5.10 | 150.13,13.97 150.13,20.32 R93.1
  Bottom 0.61: IC2.9 130.44,22.23 135.53,22.23 138.06,24.77 146.32,24.77 147.59,23.5 R93.1
N$169
  Bottom 0.406: 143.78,11.43 148.86,11.43
  Bottom 0.61: IC2.7 134.89,17.78 132.99,15.88 132.99,12.7 134.25,11.43 143.78,11.43 SV5.9 | R94.1 148.86,17.78 150.13,16.51 150.13,12.7 148.86,11.43
N$170
  Top 0.61: IC2.6 SV5.8
  Bottom 0.61: IC2.6 137.43,16.51 146.32,16.51 R95.1
N$171
  Top 0.61: IC14.9 101.87,71.12 101.87,83.82 SV6.5
  Bottom 0.61: R106.1 104.41,87.63 SV6.5
N$172
  Top 0.61: SV5.7 146.32,12.7 R96.1
  Bottom 0.61: IC2.5 137.43,13.97 146.32,13.97 R96.1
N$173
  Top 0.61: R110.1 109.49,88.9 108.22,87.63 108.22,85.09 SV6.4
  Bottom 0.61: IC14.7 105.68,83.82 SV6.4
N$174
  Top 0.61: IC14.6 105.68,80.01 105.68,85.09 SV6.3
  Bottom 0.61: SV6.3 R111.1
N$175
  Top 0.61: 118.38,81.92 116.47,80.01 115.2,80.01 113.3,78.11 IC14.4 | SV3.4 118.38,81.92 | R113.1 122.83,88.27 122.83,82.55 122.19,81.92 118.38,81.92
N$176
  Top 0.61: IC14.2 120.92,80.01 123.46,80.01 124.73,81.28 124.73,83.82 126,85.09 131.08,85.09 133.62,87.63 137.43,87.63 141.24,83.82 145.05,83.82 SV2.6
  Bottom 0.61: SV2.6 R115.1
N$177
  Top 0.61: R97.1 146.32,10.16 145.05,8.89 142.51,8.89 SV5.6
  Bottom 0.61: IC2.4 133.62,10.16 132.99,9.53 132.99,6.99 133.62,6.35 139.97,6.35 SV5.6
N$178
  Bottom 0.61: IC2.3 137.43,8.89 142.51,8.89 SV5.5 R98.1
N$179
  Bottom 0.61: R64.2 9.79,83.82 8.53,82.55 8.53,74.3 4.08,69.85 SV8.1
N$180
  Bottom 0.61: IC2.2 SV5.4 142.51,6.35 146.32,6.35 R99.1
N$181
  Bottom 0.61: R65.2 9.16,85.09 5.35,85.09 SV9.5
N$182
  Bottom 0.61: IC2.1 137.43,3.81 142.51,3.81 SV5.3 145.05,5.08 R100.1
N$183
  Bottom 0.61: SV9.4 8.53,88.27 9.79,88.27 R66.2
N$184
  Top 0.406: 150.13,59.69 142.51,59.69
  Top 0.61: 142.51,59.69 SV1.10 | R78.1 150.13,63.5 151.4,62.23 151.4,60.96 150.13,59.69
  Bottom 0.61: IC3.7 137.43,64.77 147.59,64.77 R78.1
N$185
  Top 0.61: R105.1 R101.1 91.71,62.23 91.71,60.96 96.79,55.88 120.28,55.88 120.92,55.88 122.19,54.61 122.19,17.78 120.92,16.51 103.14,16.51 101.87,17.78 89.81,17.78 86.63,14.61 86.63,6.35 IC1.20
  Bottom 0.406: 6.62,20.32 12.97,20.32 34.56,20.32
  Bottom 0.61: R105.1 85.36,78.74 R102.1 | R101.1 R104.1 | IC1.20 81.55,1.27 37.73,1.27 35.83,3.18 35.83,19.05 34.56,20.32 | SV4.1 6.62,20.32 | SV7.1 1.54,40.64 1.54,25.4 3.45,23.5 11.7,23.5 12.97,22.23 12.97,20.32
N$186
  Bottom 0.61: Q6.2 72.66,74.93 72.03,75.56 72.03,77.47 73.3,78.74 R102.2
N$187
  Bottom 0.406: 5.35,86.36 5.35,90.17
  Bottom 0.61: R67.2 6.62,91.44 5.35,90.17 | SV9.3 5.35,86.36
N$188
  Top 0.61: IC14.5 110.76,78.11 113.94,81.28 113.94,86.36 | R112.1 113.94,87.63 113.94,86.36 | 113.94,86.36 SV3.5
N$189
  Bottom 0.61: R105.2 Q7.2
N$190
  Top 0.61: SV3.3 R114.1
  Bottom 0.61: IC14.3 115.84,78.74 117.11,80.01 120.92,80.01 122.19,81.28 122.19,85.09 119.65,85.09 SV3.3
N$191
  Bottom 0.61: IC14.1 123.46,80.01 123.46,83.82 124.73,85.09 142.51,85.09 | SV2.5 142.51,85.09 | 142.51,85.09 143.78,83.82 R116.1
N$192
  Bottom 0.61: R101.2 83.45,59.69 Q2.2
N$193
  Bottom 0.406: 11.7,92.71 11.7,90.17 7.89,90.17
  Bottom 0.61: 11.7,92.71 R68.2 | SV9.2 7.89,90.17
N$194
  Top 0.61: R80.1 145.05,54.61 142.51,54.61 SV1.8
  Bottom 0.61: IC3.5 138.06,59.05 138.06,57.15 139.34,55.88 SV1.8
N$195
  Bottom 0.61: R104.2 72.66,59.69 Q3.2
N$196
  Top 0.61: R109.1 70.75,76.2 70.12,75.56 70.12,74.3 70.75,73.66 70.75,72.39 Q6.3
  Bottom 0.61: Q6.3 R107.2
N$197
  Bottom 0.61: R103.1 79.01,60.96 77.74,62.23 Q3.3 73.93,67.95 75.2,69.22 R108.1
N$198
  Bottom 0.61: R103.2 89.17,59.69 93.61,59.69 Q4.2
N$199
  Bottom 0.61: R109.2 81.55,74.93 Q5.2
N$200
  Top 0.61: IC1.21 86.63,3.81 84.09,1.27 31.38,1.27 31.38,49.53 25.67,49.53 24.4,48.26 24.4,46.99 19.32,46.99 18.05,48.26 1.54,48.26 1.54,88.9 SV9.1
N$201
  Bottom 0.61: R117.2 SV13.5 72.66,35.56 73.93,36.83 73.93,38.73 74.56,39.37 79.01,39.37 IC1.4
N$202
  Bottom 0.61: SV13.3 63.77,34.29 63.14,33.65 R118.2
N$203
  Top 0.61: R120.2 SV13.6
  Bottom 0.61: R120.2 71.39,46.99 IC1.3
N$204
  Bottom 0.61: IC1.35 101.87,36.83 SV11.16 SV11.15
N$205
  Top 0.61: SV13.4 R119.2
N$206
  Bottom 0.61: IC1.2 81.55,52.07 R121.2 SV14.5
N$207
  Bottom 0.61: SV14.3 R122.2
N$208
  Top 0.61: SV14.6 R124.2
  Bottom 0.61: IC1.1 81.55,54.61 70.12,54.61 SV14.6
N$209
  Bottom 0.61: X2.1 66.31,88.02 66.31,83.19 67.58,81.92 76.47,81.92 77.74,83.19 SV10.1
N$210
  Bottom 0.61: IC1.36 100.6,43.18 112.03,43.18 113.3,44.45 SV11.22 SV11.21
N$211
  Bottom 0.61: IC1.37 109.49,44.45 113.94,48.89 113.94,50.8 115.2,52.07 SV11.28 SV11.27
N$212
  Top 0.61: SV14.4 R123.2
N$213
  Bottom 0.61: IC1.38 96.79,49.53 96.79,53.34 104.41,60.96 114.57,60.96 SV11.34 SV11.33
N$214
  Top 0.406: 152.67,52.07 139.97,52.07
  Top 0.61: SV1.14 139.65,61.91 139.65,52.39 139.97,52.07 | 152.67,52.07 153.94,53.34 153.94,76.2 151.4,78.74 R74.1
  Bottom 0.61: R74.1 IC5.3
N$215
  Bottom 0.61: IC1.39 101.87,52.07 SV12.4 SV12.3
N$216
  Top 0.61: SV1.12 142.51,62.23 142.51,64.77 145.05,64.77 R76.1
  Bottom 0.61: R76.1 143.78,73.66 IC5.1
N$217
  Bottom 0.61: IC1.40 SV12.10 SV12.9
N$218
  Top 0.61: Q4.3 100.6,57.15 SV12.8 | SV12.1 SV11.26
  Bottom 0.61: SV11.31 SV11.32 SV12.7 SV12.8 106.31,57.15 105.05,55.88 105.05,53.97 105.68,53.34 110.76,53.34 111.39,52.7 111.39,50.8 110.12,49.53 SV12.1 SV12.2 | SV11.25 SV11.26
N$219
  Bottom 0.61: IC1.18 70.12,8.89 SV15.4
N$220
  Bottom 0.61: IC1.19 75.2,6.35 72.66,3.81 SV15.5
N$221
  Top 0.61: IC1.17 75.2,2.54 68.85,2.54 SV15.3
N$222
  Top 0.61: 75.2,36.2 77.11,36.2 77.11,38.1
N$237
  Top 0.61: Q5.3 82.19,71.76 82.19,69.22 90.44,60.96 90.44,55.88 91.71,54.61 100.6,54.61 101.87,53.34 101.87,48.26 103.14,46.99 SV11.24 SV11.23 119.65,46.99 120.92,45.72 120.92,40.64 119.65,39.37 SV11.17 SV11.18 114.57,39.37 113.3,38.1 113.3,33.02 114.57,31.75 SV11.12
  Bottom 0.61: SV11.11 SV11.12 | SV11.6 SV11.5 120.28,24.13 122.19,26.04 122.19,45.72 120.92,46.99 SV11.23 SV11.24
N$238
  Top 0.61: SV11.8 113.3,26.67 113.3,19.05 SV11.2 | Q2.3 84.09,55.88 80.92,52.7 80.92,42.54 82.82,40.64 104.41,40.64 105.68,41.91 SV11.20
  Bottom 0.61: SV11.1 SV11.2 | SV11.8 SV11.7 119.02,26.67 120.28,27.94 120.28,34.29 | SV11.14 SV11.13 120.28,34.29 | SV11.20 SV11.19 119.02,41.91 120.28,40.64 120.28,34.29
N$251
  Top 0.61: Q7.3 91.71,69.85 99.33,62.23 SV12.12
  Bottom 0.61: SV12.6 SV12.5 SV11.30 SV11.29 119.02,54.61 120.28,54.61 120.92,55.24 120.92,56.51 120.92,60.96 120.92,61.59 120.28,62.23 SV11.35 SV11.36 SV12.11 SV12.12
VCC
  Top 0.61: SV10.2 79.01,93.98 80.28,92.71 80.28,90.81 82.19,88.9 R3.1 82.19,81.92 84.09,80.01 Q5.1 | Q7.1 94.25,69.85 94.89,69.22 R108.2 101.23,64.14 119.65,64.14 120.92,65.41 C10.2 IC14.16 | SV3.2 119.65,85.09 119.65,87.63 120.28,88.27 120.28,96.52 R114.2 | R70.2 143.15,96.52 145.05,94.62 SV2.2 | 91.71,93.98 94.25,96.52 R106.2 | 91.71,93.98 91.71,88.9 C7.+ | IC6.16 C11.1 56.15,21.59 | 56.15,21.59 56.15,23.5 55.52,24.13 R118.1 55.52,45.08 R119.1 R122.1 56.15,62.23 | SV15.2 65.04,10.16 63.77,11.43 56.15,11.43 56.15,21.59 | IC1.30 91.71,26.67 90.44,25.4 81.55,25.4 R4.1 | 6.62,25.4 SV4.2 | 6.62,25.4 3.45,25.4 1.54,27.3 1.54,45.72 6.62,45.72 SV7.2 | IC13.9 28.21,25.4 26.94,25.4 | 26.94,25.4 26.94,48.26 IC12.9 | 56.15,62.23 R123.1 | R117.1 R120.1 R121.1 R124.1 56.15,62.23 | IC11.9 28.21,72.39 26.94,73.66 26.94,95.89 27.57,96.52 IC10.9 30.75,97.79 84.09,97.79 86.63,93.98 91.71,93.98 | 26.94,25.4 6.62,25.4
  Bottom 0.406: 82.82,77.47 79.01,77.47 | 150.76,46.99 142.51,46.99
  Bottom 0.61: R3.1 87.9,85.73 C7.+ | Q6.1 76.47,72.39 77.74,73.66 77.74,76.2 79.01,77.47 | 82.82,77.47 84.09,76.2 Q5.1 92.98,72.39 Q7.1 | R88.2 R86.2 | R88.2 R89.2 | R88.2 R87.2 R86.2 | R89.2 R90.2 R91.2 R92.2 | 155.21,43.81 141.88,43.81 141.24,43.18 134.25,43.18 132.99,41.91 132.99,27.94 131.72,26.67 131.08,26.67 | R92.2 R89.2 | 141.24,1.27 129.81,1.27 IC2.16 C12.2 | SV5.2 141.24,1.27 | 141.24,1.27 141.56,0.95 153.94,0.95 155.21,2.22 R100.2 R99.2 R98.2 R97.2 R96.2 R95.2 R94.2 R93.2 R92.2 | SV6.2 112.03,81.28 119.65,81.28 120.92,82.55 SV3.2 | R106.2 R111.2 R110.2 R112.2 R114.2 R113.2 R70.2 | R84.2 R85.2 156.48,45.08 155.21,43.81 | R84.2 R83.2 R82.2 R81.2 R80.2 R79.2 R78.2 R77.2 R76.2 R75.2 R73.2 R71.2 R74.2 R72.2 R116.2 R115.2 R69.2 153.31,88.9 150.76,91.44 SV2.2 | 142.51,46.99 SV1.2 132.35,48.26 C9.2 132.35,49.53 131.08,50.8 IC3.16 | 150.76,46.99 152.03,48.26 R84.2 | 155.21,43.81 R86.2 | C4.2 104.41,24.13 101.87,26.67 IC1.30 | 80.28,29.21 R4.1 65.67,26.67 65.04,26.04 60.59,26.04 58.69,27.94 R118.1 | C5.2 80.28,29.21 | 80.28,29.21 IC1.10 | IC10.9 51.07,96.52 52.34,95.25 IC9.16 55.52,93.98 56.15,93.34 C15.1 | IC11.9 45.99,72.39 48.53,69.85 IC8.16 58.69,69.85 59.96,68.58 59.96,67.31 | R119.1 IC7.16 | SV16.2 68.85,38.1 66.31,40.64 63.77,40.64 62.18,42.23 R120.1 C13.1 | IC12.9 35.83,48.26 36.47,48.89 55.52,48.89 R122.1 | R123.1 57.42,64.77 59.96,67.31 | 131.08,26.67 IC4.16 | C8.2 131.08,26.67 | IC14.16 124.73,69.85 IC5.16 | C14.1 59.96,67.31

## Text on the board
Top: U+E | EPWR | LED5 | USB | 5V/.5A | Kill1-2 | BuM | LED1-4 | JG1 | ISP | ADC 2 | BuL | ADC 1 | VU2 | JG2 | VU1 | BuR | MixxxCtl v0.2 | ENC1 | Fabian Lesniak | 2012